# Altium schematic sheet IR emitter.SchDoc
size A3; SheetNumber: 1; SheetTotal: 1
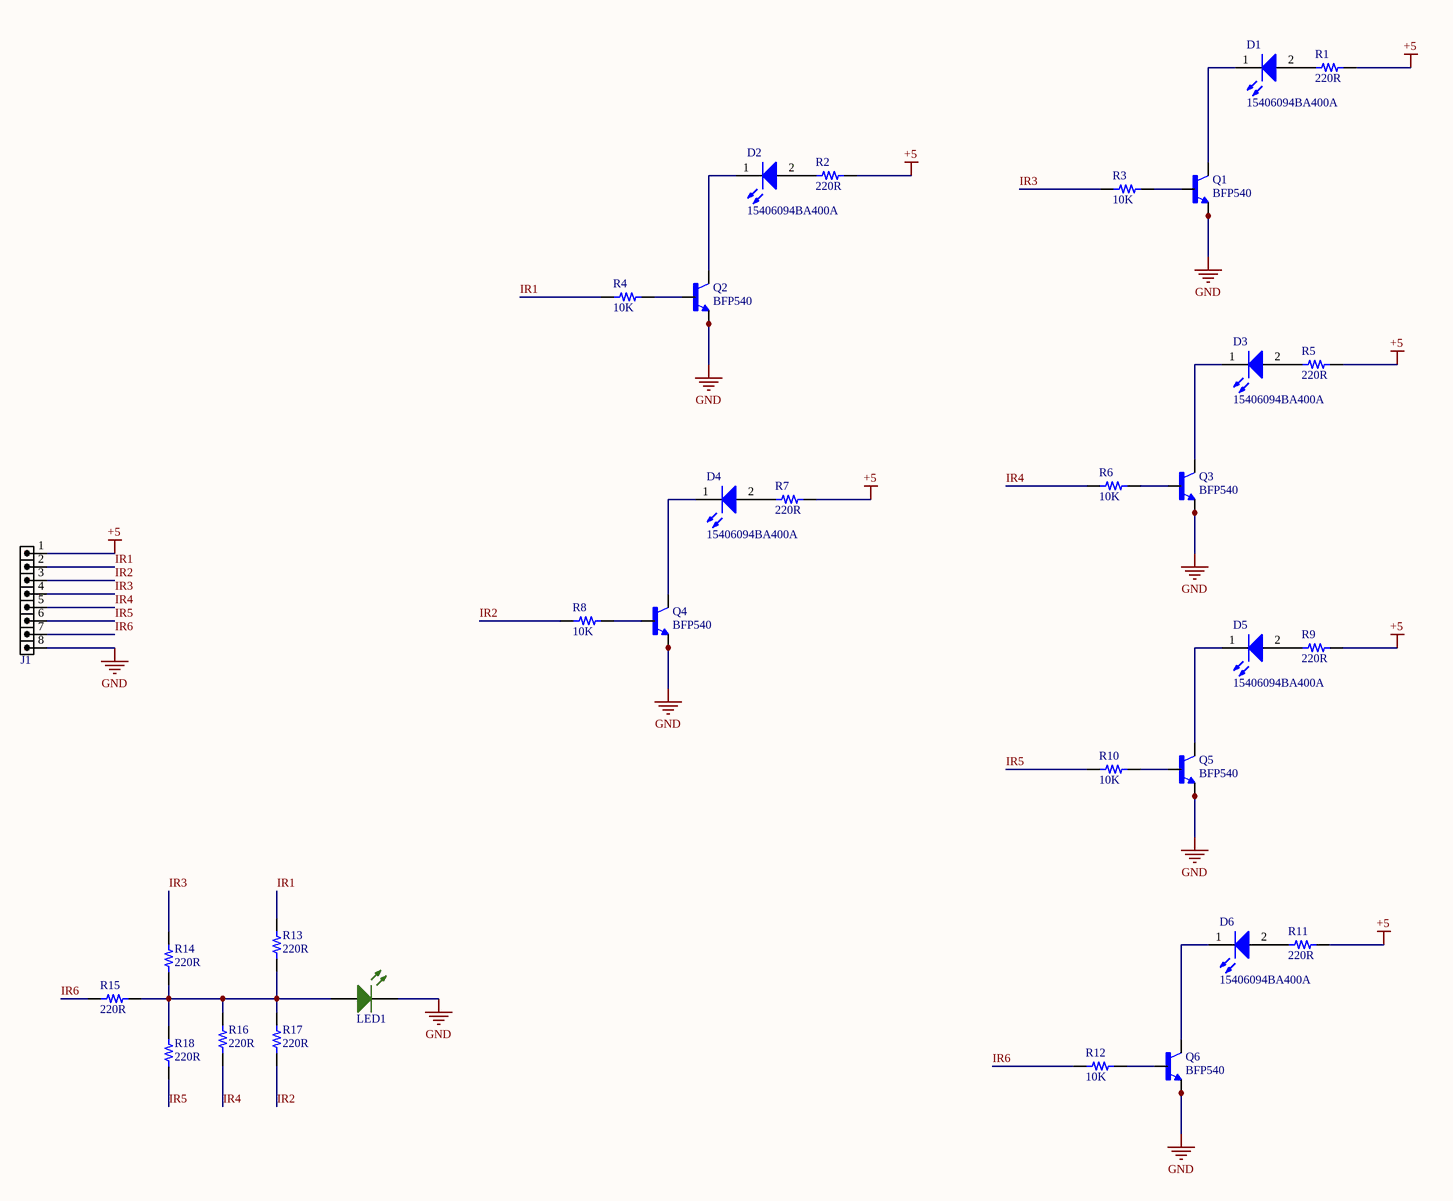
[diagram p0: IR emitter.SchDoc]

## Parts
D1  15406094BA400A  [WL-SICW_0603_L1.6W0.8H0.88]
D2  15406094BA400A  [WL-SICW_0603_L1.6W0.8H0.88]
D3  15406094BA400A  [WL-SICW_0603_L1.6W0.8H0.88]
D4  15406094BA400A  [WL-SICW_0603_L1.6W0.8H0.88]
D5  15406094BA400A  [WL-SICW_0603_L1.6W0.8H0.88]
D6  15406094BA400A  [WL-SICW_0603_L1.6W0.8H0.88]
J1  HDR1X8  [HDRR_M_1X8]  (value not drawn)
LED1  LED SMD 0603 GREEN  [LED_0603_GREEN]  (value not drawn)
Q1  BFP540  [TRANS_BFP540]
Q2  BFP540  [TRANS_BFP540]
Q3  BFP540  [TRANS_BFP540]
Q4  BFP540  [TRANS_BFP540]
Q5  BFP540  [TRANS_BFP540]
Q6  BFP540  [TRANS_BFP540]
R1  220R  [RES 0603_1608]
R2  220R  [RES 0603_1608]
R3  10K  [RES 0603_1608]
R4  10K  [RES 0603_1608]
R5  220R  [RES 0603_1608]
R6  10K  [RES 0603_1608]
R7  220R  [RES 0603_1608]
R8  10K  [RES 0603_1608]
R9  220R  [RES 0603_1608]
R10  10K  [RES 0603_1608]
R11  220R  [RES 0603_1608]
R12  10K  [RES 0603_1608]
R13  220R  [RES 0603_1608]
R14  220R  [RES 0603_1608]
R15  220R  [RES 0603_1608]
R16  220R  [RES 0603_1608]
R17  220R  [RES 0603_1608]
R18  220R  [RES 0603_1608]

## Nets
+5: J1.1 R1.1 R2.1 R5.1 R7.1 R9.1 R11.1
GND: J1.8 LED1.2(K) Q1.2(E) Q1.4(E) Q2.2(E) Q2.4(E) Q3.2(E) Q3.4(E) Q4.2(E) Q4.4(E) Q5.2(E) Q5.4(E) Q6.2(E) Q6.4(E)
IR1: J1.2 R4.2 R13.1
IR2: J1.3 R8.2 R17.2
IR3: J1.4 R3.2 R14.1
IR4: J1.5 R6.2 R16.2
IR5: J1.6 R10.2 R18.2
IR6: J1.7 R12.2 R15.2
NetD1_1: D1.1(K) Q1.3(C)
NetD1_2: D1.2(A) R1.2
NetD2_1: D2.1(K) Q2.3(C)
NetD2_2: D2.2(A) R2.2
NetD3_1: D3.1(K) Q3.3(C)
NetD3_2: D3.2(A) R5.2
NetD4_1: D4.1(K) Q4.3(C)
NetD4_2: D4.2(A) R7.2
NetD5_1: D5.1(K) Q5.3(C)
NetD5_2: D5.2(A) R9.2
NetD6_1: D6.1(K) Q6.3(C)
NetD6_2: D6.2(A) R11.2
NetLED1_1: LED1.1(A) R13.2 R14.2 R15.1 R16.1 R17.1 R18.1
NetQ1_1: Q1.1(B) R3.1
NetQ2_1: Q2.1(B) R4.1
NetQ3_1: Q3.1(B) R6.1
NetQ4_1: Q4.1(B) R8.1
NetQ5_1: Q5.1(B) R10.1
NetQ6_1: Q6.1(B) R12.1

## Library data of the parts
D1-D6 = CMP-03913-108242140-1: 15406094BA400A Ir Emitter, 940Nm, 0603 Rohs Compliant: Yes; Max Reverse Voltage (DC): 5V; Forward Current: 700mA; Forward Voltage: 1.2V; Viewing Angle: 140°; RoHS: Compliant; Peak Wavelength: 940nm; Width: 800µm; Min Operating Temperature: -40°C; NexarPartId: 108242140; Length: 1.6mm; Max Operating Temperature: 85°C; Height: 900µm
J1 = HDRR_M_1X8: CONN, HEADER, RightAngle, Male, pitch: 2.54mm, 8POS; VALUE: HDRM8
Q1-Q6 = BFP540: RF Transistor NPN 5V 80mA 30GHz 250mW Surface Mount PG-SOT343-4; MF: Infineon; Package: SOT-343 Infineon; Price: None; Check_prices: https://www.snapeda.com/parts/BFP540/Infineon/view-part/?ref=eda; Value: *; SnapEDA_Link: https://www.snapeda.com/parts/BFP540/Infineon/view-part/?ref=snap; MP: BFP540; Availability: In Stock; Purchase-URL: https://pricing.snapeda.com/search/part/BFP540/?ref=eda
R1-R18 = Res 0603: SMT Resistor; VALUE: 1K